# EAGLE design quadcopter (EAGLE 7.5.0)
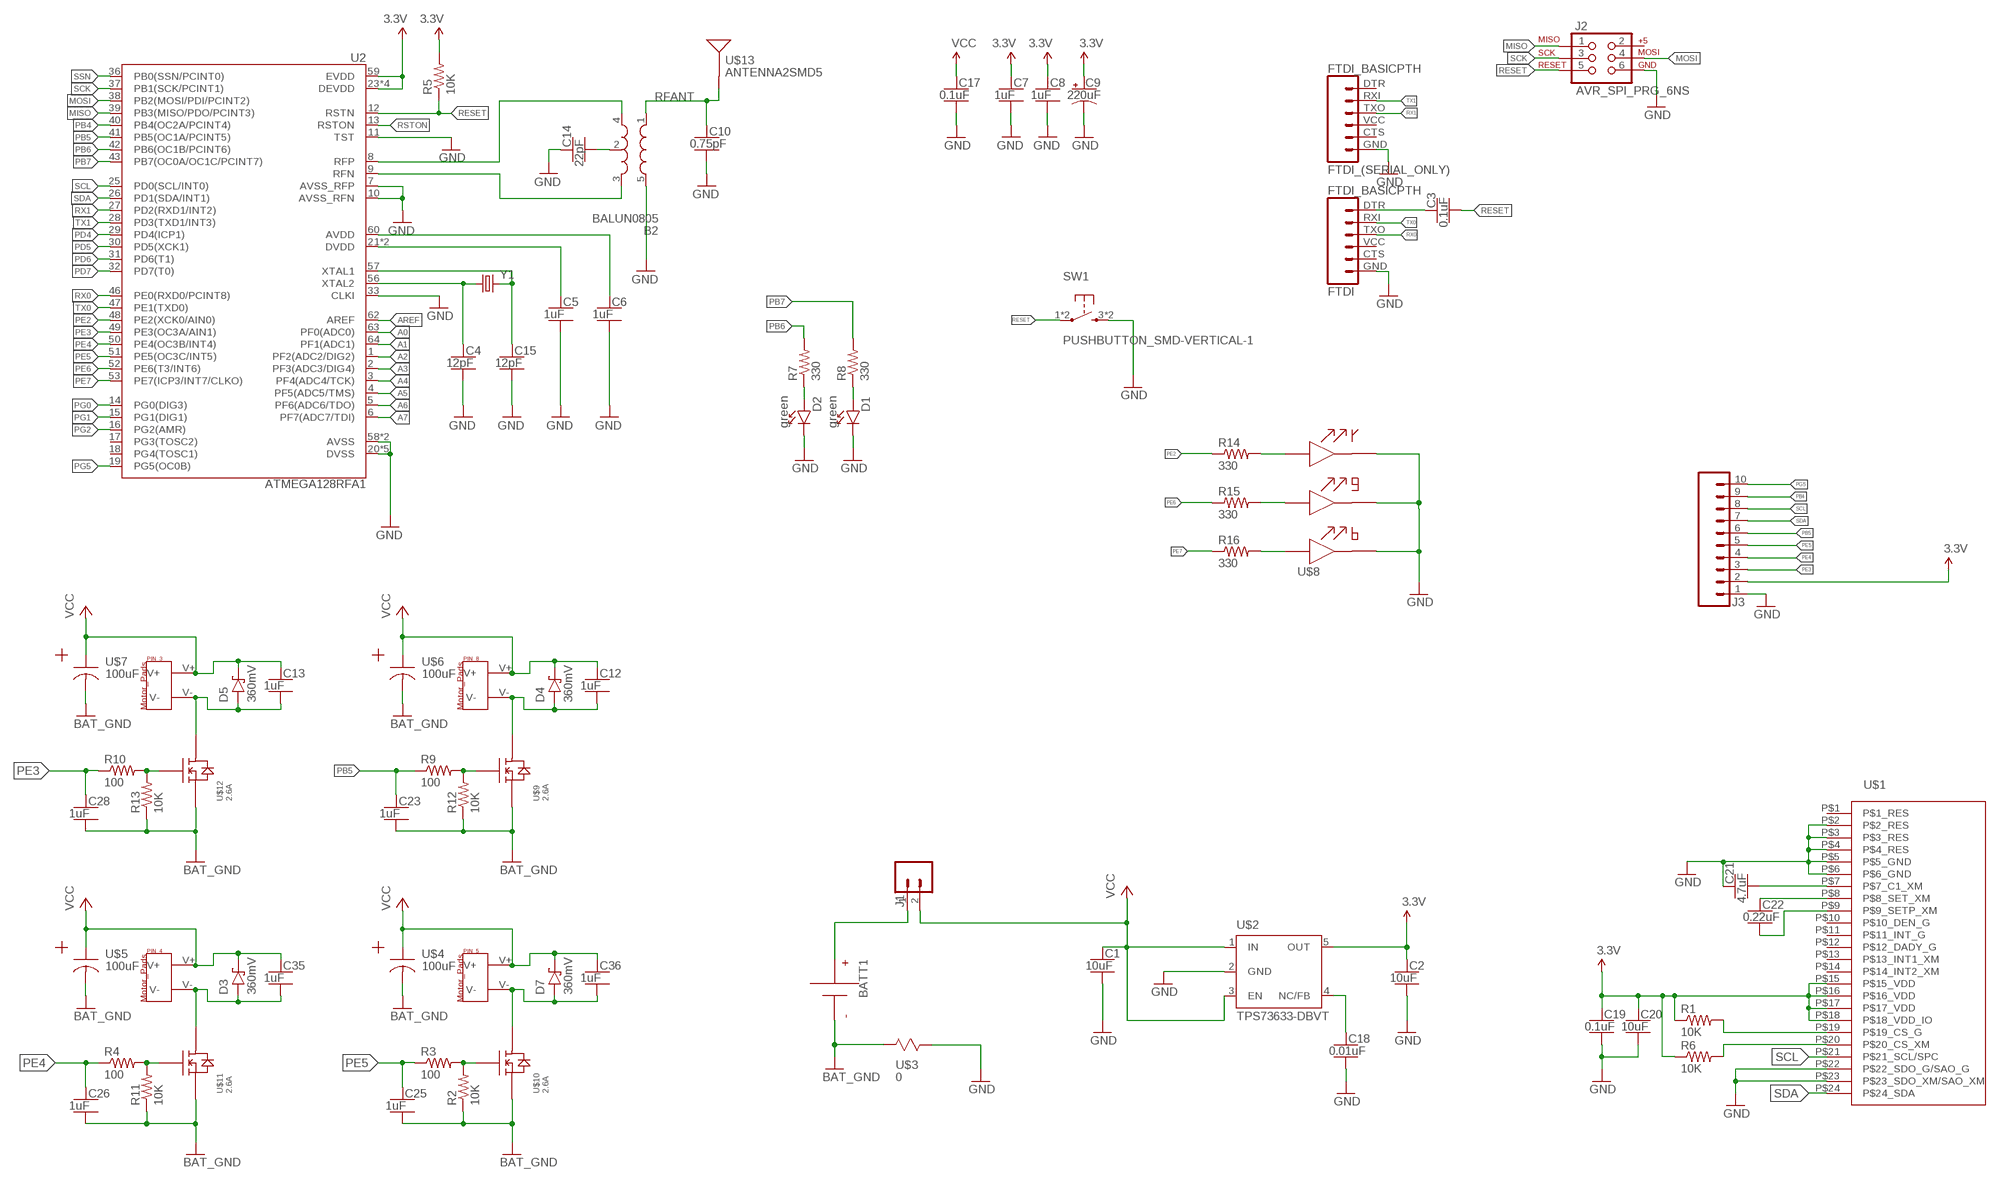
[diagram p0: schematic, sheet 1]

## Parts
B2  BALUN0805  [BALUN]
BATT1  BATTERY-HUBSAN-W/HOLDER  [BATTERY-W/HOLDER-380MAH-HUBSAN]
C1  10uF  CAPACITOR-NP_SMD-2012-0805_CERAMIC-10UF  [CAPC2012X140_HS]
C2  10uF  CAPACITOR-NP_SMD-2012-0805_CERAMIC-10UF  [CAPC2012X140_HS]
C3  0.1uF  CAPACITOR-NP_SMD-2012-0805_CERAMIC-0.1UF  [CAPC2012X140_HS]
C4  12pF  CAPACITOR-NP_SMD-2012-0805_CERAMIC-12PF  [CAPC2012X140_HS]
C5  1uF  CAPACITOR-NP_SMD-2012-0805_CERAMIC-1UF  [CAPC2012X140_HS]
C6  1uF  CAPACITOR-NP_SMD-2012-0805_CERAMIC-1UF  [CAPC2012X140_HS]
C7  1uF  CAPACITOR-NP_SMD-2012-0805_CERAMIC-1UF  [CAPC2012X140_HS]
C8  1uF  CAPACITOR-NP_SMD-2012-0805_CERAMIC-1UF  [CAPC2012X140_HS]
C9  220uF  CAPACITOR-POL_SMD-7043-D_TANTALUM-220UF  [CAPMP7343X310_HS]
C10  0.75pF  CAPACITOR-NP_SMD-2012-0805_CERAMIC-0.75PF  [CAPC2012X140_HS]
C12  1uF  CAPACITOR-NP_SMD-2012-0805_CERAMIC-1UF  [CAPC2012X140_HS]
C13  1uF  CAPACITOR-NP_SMD-2012-0805_CERAMIC-1UF  [CAPC2012X140_HS]
C14  22pF  CAPACITOR-NP_SMD-2012-0805_CERAMIC-22PF  [CAPC2012X140_HS]
C15  12pF  CAPACITOR-NP_SMD-2012-0805_CERAMIC-12PF  [CAPC2012X140_HS]
C17  0.1uF  CAPACITOR-NP_SMD-2012-0805_CERAMIC-0.1UF  [CAPC2012X140_HS]
C18  0.01uF  CAPACITOR-NP_SMD-2012-0805_CERAMIC-0.01UF  [CAPC2012X140_HS]
C19  0.1uF  CAPACITOR-NP_SMD-2012-0805_CERAMIC-0.1UF  [CAPC2012X140_HS]
C20  10uF  CAPACITOR-NP_SMD-2012-0805_CERAMIC-10UF  [CAPC2012X140_HS]
C21  4.7uF  CAPACITOR-NP_SMD-2012-0805_CERAMIC-4.7UF  [CAPC2012X140_HS]
C22  0.22uF  CAPACITOR-NP_SMD-2012-0805_CERAMIC-0.22UF  [CAPC2012X140_HS]
C23  1uF  CAPACITOR-NP_SMD-2012-0805_CERAMIC-1UF  [CAPC2012X140_HS]
C25  1uF  CAPACITOR-NP_SMD-2012-0805_CERAMIC-1UF  [CAPC2012X140_HS]
C26  1uF  CAPACITOR-NP_SMD-2012-0805_CERAMIC-1UF  [CAPC2012X140_HS]
C28  1uF  CAPACITOR-NP_SMD-2012-0805_CERAMIC-1UF  [CAPC2012X140_HS]
C35  1uF  CAPACITOR-NP_SMD-2012-0805_CERAMIC-1UF  [CAPC2012X140_HS]
C36  1uF  CAPACITOR-NP_SMD-2012-0805_CERAMIC-1UF  [CAPC2012X140_HS]
D1  green  DIODE-LED_SMD-2012-0805-GREEN  [LEDSC125X200X120-2_HS]
D2  green  DIODE-LED_SMD-2012-0805-GREEN  [LEDSC125X200X120-2_HS]
D3  360mV  DIODE-SCHOTTKY_SMD-SOD123-360MV  [SOD3716X135_HS]
D4  360mV  DIODE-SCHOTTKY_SMD-SOD123-360MV  [SOD3716X135_HS]
D5  360mV  DIODE-SCHOTTKY_SMD-SOD123-360MV  [SOD3716X135_HS]
D7  360mV  DIODE-SCHOTTKY_SMD-SOD123-360MV  [SOD3716X135_HS]
FTDI  FTDI_BASICPTH  [FTDI_BASIC]
FTDI_(SERIAL_ONLY)  FTDI_BASICPTH  [FTDI_BASIC]
J1  MALE_HEADER_2POS-2X1-0.1IN  [MALE_HEADER_2X1_0.1IN]
J2  AVR_SPI_PRG_6NS  [2X3-NS]
J3  SIP-10_TH-254X10-1  [HDRV10W63P254_10X1_2540X254H838_HS]
PIN_3  MOTOR_PADS  [MOTOR_PADS]
PIN_4  MOTOR_PADS  [MOTOR_PADS]
PIN_5  MOTOR_PADS  [MOTOR_PADS]
PIN_8  MOTOR_PADS  [MOTOR_PADS]
R1  10K  RESISTOR_SMD-2012-0805-10K  [RESC2012X60_HS]
R2  10K  RESISTOR_SMD-2012-0805-10K  [RESC2012X60_HS]
R3  100  RESISTOR_SMD-2012-0805-100  [RESC2012X60_HS]
R4  100  RESISTOR_SMD-2012-0805-100  [RESC2012X60_HS]
R5  10K  RESISTOR_SMD-2012-0805-10K  [RESC2012X60_HS]
R6  10K  RESISTOR_SMD-2012-0805-10K  [RESC2012X60_HS]
R7  330  RESISTOR_SMD-2012-0805-330  [RESC2012X60_HS]
R8  330  RESISTOR_SMD-2012-0805-330  [RESC2012X60_HS]
R9  100  RESISTOR_SMD-2012-0805-100  [RESC2012X60_HS]
R10  100  RESISTOR_SMD-2012-0805-100  [RESC2012X60_HS]
R11  10K  RESISTOR_SMD-2012-0805-10K  [RESC2012X60_HS]
R12  10K  RESISTOR_SMD-2012-0805-10K  [RESC2012X60_HS]
R13  10K  RESISTOR_SMD-2012-0805-10K  [RESC2012X60_HS]
R14  330  RESISTOR_SMD-2012-0805-330  [RESC2012X60_HS]
R15  330  RESISTOR_SMD-2012-0805-330  [RESC2012X60_HS]
R16  330  RESISTOR_SMD-2012-0805-330  [RESC2012X60_HS]
SW1  PUSHBUTTON_SMD-VERTICAL-1  [TE_FSM8JSMA_HS]
U2  ATMEGA128RFA1  [QFN-64]
U$1  IMU  [LGA-24_4X4MM]
U$2  TPS73633-DBVT  [SOT23-DBV]
U$3  0  RESISTOR  [SMD_RESISTOR]
U$4  100uF  POLAR_CAP  [TAJB_SMB_POLAR_CAP]
U$5  100uF  POLAR_CAP  [TAJB_SMB_POLAR_CAP]
U$6  100uF  POLAR_CAP  [TAJB_SMB_POLAR_CAP]
U$7  100uF  POLAR_CAP  [TAJB_SMB_POLAR_CAP]
U$8  QBLP679E-RGB  [QBLP679E-RGB]
U$9  2.6A  N-CHANNEL_MOSFETW/_HEAT_SINK  [LITTLE_FOOT_MOSFET_W/_HEAT_SPREADER]
U$10  2.6A  N-CHANNEL_MOSFETW/_HEAT_SINK  [LITTLE_FOOT_MOSFET_W/_HEAT_SPREADER]
U$11  2.6A  N-CHANNEL_MOSFETW/_HEAT_SINK  [LITTLE_FOOT_MOSFET_W/_HEAT_SPREADER]
U$12  2.6A  N-CHANNEL_MOSFETW/_HEAT_SINK  [LITTLE_FOOT_MOSFET_W/_HEAT_SPREADER]
U$13  ANTENNA2SMD5  [ANTENNA-CHIP5]
Y1  CRYSTAL5X3  [CRYSTAL-SMD-5X3]

## Nets
3.3V: C2.1 C7.1 C8.1 C9.1(+) C19.1 C20.1 J3.2 R1.1 R5.2 R6.1 U2.23(DEVDD) U2.34(DEVDD) U2.44(DEVDD) U2.54(DEVDD) U2.59(EVDD) U$1.P$15(P$15_VDD) U$1.P$16(P$16_VDD) U$1.P$17(P$17_VDD) U$1.P$18(P$18_VDD_IO) U$2.5(OUT)
A0: U2.63(PF0(ADC0))
A1: U2.64(PF1(ADC1))
A2: U2.1(PF2(ADC2/DIG2))
A3: U2.2(PF3(ADC3/DIG4))
A4: U2.3(PF4(ADC4/TCK))
A5: U2.4(PF5(ADC5/TMS))
A6: U2.5(PF6(ADC6/TDO))
A7: U2.6(PF7(ADC7/TDI))
AREF: U2.62(AREF)
AVDD: C6.1 U2.60(AVDD)
BAT_GND: BATT1.-(N) C23.2 C25.2 C26.2 C28.2 R2.1 R11.1 R12.1 R13.1 U$3.P$1 U$4.P$2 U$5.P$2 U$6.P$2 U$7.P$2 U$9.P$2(P$2_S) U$10.P$2(P$2_S) U$11.P$2(P$2_S) U$12.P$2(P$2_S)
DTR: C3.1 FTDI.DTR
DVDD: C5.1 U2.21(DVDD) U2.22(DVDD)
GND: B2.5(GND) C1.2 C2.2 C4.2 C5.2 C6.2 C7.2 C8.2 C9.2(-) C10.2 C14.1 C15.2 C17.2 C18.2 C19.2 C20.2 C21.1 D1.C D2.C FTDI.GND FTDI_(SERIAL_ONLY).GND J2.6 J3.1 SW1.3 SW1.4 U2.7(AVSS_RFP) U2.10(AVSS_RFN) U2.11(TST) U2.20(DVSS) U2.24(DVSS) U2.33(CLKI) U2.35(DVSS) U2.45(DVSS) U2.55(DVSS) U2.58(AVSS) U2.61(AVSS) U$1.P$2(P$2_RES) U$1.P$3(P$3_RES) U$1.P$4(P$4_RES) U$1.P$5(P$5_GND) U$1.P$6(P$6_GND) U$1.P$22(P$22_SDO_G/SAO_G) U$1.P$23(P$23_SDO_XM/SAO_XM) U$2.2(GND) U$3.P$2 U$8.P$1 U$8.P$2 U$8.P$3
MISO: J2.1 U2.39(PB3(MISO/PDO/PCINT3))
MOSI: J2.4 U2.38(PB2(MOSI/PDI/PCINT2))
N$1: R14.2 U$8.P$4
N$2: R15.2 U$8.P$5
N$3: C15.1 U2.57(XTAL1) Y1.3
N$4: C4.1 U2.56(XTAL2) Y1.1
N$5: C18.1 U$2.4(NC/FB)
N$6: C21.2 U$1.P$7(P$7_C1_XM)
N$7: B2.2(GND) C14.2
N$8: D2.A R7.1
N$9: R16.2 U$8.P$6
N$12: C22.1 U$1.P$8(P$8_SET_XM)
N$13: D1.A R8.1
N$14: C22.2 U$1.P$9(P$9_SETP_XM)
N$15: R1.2 U$1.P$19(P$19_CS_G)
N$16: R6.2 U$1.P$20(P$20_CS_XM)
N$17: BATT1.+(P) J1.1
N$18: R9.2 R12.2 U$9.P$1(P$1_G)
N$19 [HighAmps]: C12.2 D4.A PIN_8.V- U$9.P$3(P$3_D)
N$21: R2.2 R3.2 U$10.P$1(P$1_G)
N$22 [HighAmps]: C36.2 D7.A PIN_5.V- U$10.P$3(P$3_D)
N$24: R10.2 R13.2 U$12.P$1(P$1_G)
N$25 [HighAmps]: C13.2 D5.A PIN_3.V- U$12.P$3(P$3_D)
N$27: R4.2 R11.2 U$11.P$1(P$1_G)
N$28 [HighAmps]: C35.2 D3.A PIN_4.V- U$11.P$3(P$3_D)
PB4: J3.9 U2.40(PB4(OC2A/PCINT4))
PB5: C23.1 J3.6 R9.1 U2.41(PB5(OC1A/PCINT5))
PB6: R7.2 U2.42(PB6(OC1B/PCINT6))
PB7: R8.2 U2.43(PB7(OC0A/OC1C/PCINT7))
PD4: U2.29(PD4(ICP1))
PD5: U2.30(PD5(XCK1))
PD6: U2.31(PD6(T1))
PD7: U2.32(PD7(T0))
PE2: R14.1 U2.48(PE2(XCK0/AIN0))
PE3: C28.1 J3.3 R10.1 U2.49(PE3(OC3A/AIN1))
PE4: C26.1 J3.4 R4.1 U2.50(PE4(OC3B/INT4))
PE5: C25.1 J3.5 R3.1 U2.51(PE5(OC3C/INT5))
PE6: R15.1 U2.52(PE6(T3/INT6))
PE7: R16.1 U2.53(PE7(ICP3/INT7/CLKO))
PG0: U2.14(PG0(DIG3))
PG1: U2.15(PG1(DIG1))
PG2: U2.16(PG2(AMR))
PG5: J3.10 U2.19(PG5(OC0B))
RESET: C3.2 J2.5 R5.1 SW1.1 SW1.2 U2.12(RSTN)
RFANT: B2.1(IN) C10.1 U$13.FEED(SIGNAL)
RFN: B2.3(OUT2) U2.9(RFN)
RFP: B2.4(OUT1) U2.8(RFP)
RSTON: U2.13(RSTON)
RX0: FTDI.TXO U2.46(PE0(RXD0/PCINT8))
RX1: FTDI_(SERIAL_ONLY).TXO U2.27(PD2(RXD1/INT2))
SCK: J2.3 U2.37(PB1(SCK/PCINT1))
SCL: J3.8 U2.25(PD0(SCL/INT0)) U$1.P$21(P$21_SCL/SPC)
SDA: J3.7 U2.26(PD1(SDA/INT1)) U$1.P$24(P$24_SDA)
SSN: U2.36(PB0(SSN/PCINT0))
TX0: FTDI.RXI U2.47(PE1(TXD0))
TX1: FTDI_(SERIAL_ONLY).RXI U2.28(PD3(TXD1/INT3))
VCC: C1.1 C12.1 C13.1 C17.1 C35.1 C36.1 D3.C D4.C D5.C D7.C J1.2 PIN_3.V+ PIN_4.V+ PIN_5.V+ PIN_8.V+ U$2.1(IN) U$2.3(EN) U$4.P$1 U$5.P$1 U$6.P$1 U$7.P$1
Unconnected: FTDI.CTS FTDI.VCC FTDI_(SERIAL_ONLY).CTS FTDI_(SERIAL_ONLY).DTR FTDI_(SERIAL_ONLY).VCC J2.2 U2.17(PG3(TOSC2)) U2.18(PG4(TOSC1)) U$1.P$1(P$1_RES) U$1.P$10(P$10_DEN_G) U$1.P$11(P$11_INT_G) U$1.P$12(P$12_DADY_G) U$1.P$13(P$13_INT1_XM) U$1.P$14(P$14_INT2_XM)

## Library data of the parts
B2 = quadparts_prebuilt:BALUN: 0805 footprint balun- Ember 351/357; DATASHEET: http://katalog.we-online.de/pbs/datasheet/748421245.pdf; DIST: Digikey; DISTPN: 732-2230-6-ND; MFR: Wurth Electronics Inc; MPN: 748421245; PRICE: 2.63
BATT1 = quadparts_prebuilt:BATTERY; CREATOR: Swanson; DIST: AMAZON; DISTPN: http://www.amazon.com/dp/B00RROB6Q4?smid=AMNTPWSAB5H0S; MFR: HUBSAN; MPN: X4-H107C-8-in-1
C1 C2 C20 = quadparts_prebuilt:CAPACITOR-NP_: Nonpolarized capacitor; DIST: Digikey; DISTPN: 490-5523-1-ND; MFR: Murata Electronics North America; MPN: GRM21BR61E106KA73L
C3 C17 C19 = quadparts_prebuilt:CAPACITOR-NP_: Nonpolarized capacitor; DIST: Digikey; DISTPN: 490-1666-1-ND; MFR: Murata Electronics North America; MPN: GRM21BR71H104KA01L
C4 C15 = quadparts_prebuilt:CAPACITOR-NP_: Nonpolarized capacitor; DIST: Digikey; DISTPN: 490-5531-1-ND; MFR: Murata Electronics North America; MPN: GRM21A5C2E120JW01D
C5-C8 C12 C13 C23 C25 C26 C28 C35 C36 = quadparts_prebuilt:CAPACITOR-NP_: Nonpolarized capacitor; DIST: Digikey; DISTPN: 490-4736-1-ND; MFR: Murata Electronics North America; MPN: GRM21BR71H105KA12L
C9 = quadparts_prebuilt:CAPACITOR-POL_: Polarized capacitor; DIST: Digikey; DISTPN: 478-8912-1-ND; MFR: AVX Corporation; MPN: TAJD227K006RNJ
C10 = quadparts_prebuilt:CAPACITOR-NP_: Nonpolarized capacitor; DIST: Digikey; DISTPN: 490-3585-1-ND; MFR: Murata Electronics North America; MPN: GQM2195C2AR75CB01D
C14 = quadparts_prebuilt:CAPACITOR-NP_: Nonpolarized capacitor; DIST: Digikey; DISTPN: 490-5534-1-ND; MFR: Murata Electronics North America; MPN: GRM21A5C2E220JW01D
C18 = quadparts_prebuilt:CAPACITOR-NP_: Nonpolarized capacitor; DIST: Digikey; DISTPN: 490-8295-1-ND; MFR: Murata Electronics North America; MPN: GRM2195C1H103FA01D
C21 = quadparts_prebuilt:CAPACITOR-NP_: Nonpolarized capacitor; DIST: Digikey; DISTPN: 490-3335-1-ND; MFR: Murata Electronics North America; MPN: GRM21BR61E475KA12L
C22 = quadparts_prebuilt:CAPACITOR-NP_: Nonpolarized capacitor; DIST: Digikey; DISTPN: 490-1670-1-ND; MFR: Murata Electronics North America; MPN: GRM21BR71H224KA01L
D1 D2 = quadparts_prebuilt:DIODE-LED_: Light emitting diode; DIST: Digikey; DISTPN: 160-1179-1-ND; MFR: Lite-On Inc; MPN: LTST-C170GKT
D3-D5 D7 = quadparts_prebuilt:DIODE-SCHOTTKY_: Schottky diode; DIST: Digikey; DISTPN: CRS08QMCT-ND; MFR: Toshiba Semiconductor and Storage; MPN: CRS08(TE85L,Q,M)
FTDI FTDI_(SERIAL_ONLY) = quadparts_prebuilt:FTDI_BASIC: FTDI Basic header with labels; DATASHEET: http://portal.fciconnect.com/Comergent//fci/drawing/68015.pdf; DIST: Digikey; DISTPN: 609-3327-ND; MFR: Amphenol FCI; MPN: 68016-406HLF; PRICE: 0.33
J1 = quadparts-rev2:MALE_HEADER_2POS: 2 pin single inline pin header, socket, or connector; CREATOR: SWANSON; DIST: Digikey; DISTPN: 3M9447-ND; MFR: 3M; MPN: 961102-6404-AR
J2 = quadparts_prebuilt:AVR_SPI_PRG_6: AVR ISP 6 Pin This is the reduced ISP connector for AVR programming. Common on Arduino. This footprint will take up less PCB space and can be used with a 10-pin to 6-pin adapter such as SKU: BOB-08508; DATASHEET: http://portal.fciconnect.com/Comergent//fci/drawing/67996.pdf; DIST: Digikey; DISTPN: 609-3234-ND; MFR: Amphenol FCI; MPN: 67997-206HLF; PRICE: 0.31
J3 = quadparts_prebuilt:SIP-10_: 10 pin single inline pin header, socket, or connector; DIST: Digikey; DISTPN: 609-3250-ND; MFR: Amphenol FCI; MPN: 68000-110HLF
PIN_3-PIN_5 PIN_8 = quadparts_prebuilt:MOTOR_PADS; DIST: NA; DISTPN: NA; MFR: NA; MPN: NA
R1 R2 R5 R6 R11-R13 = quadparts_prebuilt:RESISTOR_: Resistor; DIST: Digikey; DISTPN: 311-10KARCT-ND; MFR: Yageo; MPN: RC0805JR-0710KL
R3 R4 R9 R10 = quadparts_prebuilt:RESISTOR_: Resistor; DIST: Digikey; DISTPN: 311-100ARCT-ND; MFR: Yageo; MPN: RC0805JR-07100RL
R7 R8 R14-R16 = quadparts_prebuilt:RESISTOR_: Resistor; DIST: Digikey; DISTPN: 311-330ARCT-ND; MFR: Yageo; MPN: RC0805JR-07330RL
SW1 = quadparts_prebuilt:PUSHBUTTON_: Pushbutton with 2 pins shorting 1 to 2 and two extra mounting pins 3 & 4; DIST: Digikey; DISTPN: 450-1129-ND; MFR: TE Connectivity Alcoswitch Switches; MPN: FSM4JSMA
U2 = quadparts_prebuilt:ATMEGA128RFA1: ATmega128RFA1 8-bit AVR Microcontroller with Low Power 2.4GHz Transceiver for ZigBee and IEEE 802.15.4; DATASHEET: http://www.atmel.com/Images/Atmel-8266-MCU_Wireless-ATmega128RFA1_Datasheet.pdf; DIST: Digikey; DISTPN: ATMEGA128RFA1-ZUR00DKR-ND; MFR: Atmel; MPN: ATMEGA128RFA1-ZUR00; PRICE: 10.21
U$1 = quadparts:IMU; CREATOR: Xuefei; DIST: DIGIKEY; DISTPN: 497-13902-1-ND; MFR: STMicroelectronics; MPN: LSM9DS0TR
U$2 = quadparts_prebuilt:TPS73633-DBVT; DATASHEET: http://www.ti.com/lit/ds/symlink/lp3985.pdf; DIST: Digikey; DISTPN: LP3985IM5X-3.0/NOPBCT-ND; MFR: Texas Instruments; MPN: LP3985IM5X-3.0/NOPB; PRICE: 0.59
U$3 = quadparts:RESISTOR; CREATOR: Xuefei; DIST: DIGIKEY; DISTPN: 311-0.0ARCT-ND; MFR: Yageo; MPN: RC0805JR-070RL
U$4-U$7 = quadparts:POLAR_CAP; CREATOR: Xuefei; DIST: DIGIKEY; DISTPN: 478-1677-1-ND; MFR: AVX Corporation; MPN: TAJB107K006RNJ
U$8 = quadparts:QBLP679E-RGB; CREATOR: Xuefei; DIST: DIGIKEY; DISTPN: 1516-1131-1-ND; MFR: QT Brightek (QTB); MPN: QBLP679E-RGB
U$9-U$12 = quadparts:N-CHANNEL_MOSFET; CREATOR: Xuefei; DIST: DIGIKEY; DISTPN: SI2302CDS-T1-E3CT-ND; MFR: Vishay Siliconix; MPN: SI2302CDS-T1-E3
U$13 = quadparts_prebuilt:ANTENNA2: Chip antenna Single endded antenna. Common with smaller chip antennas. CHIP4 package is the GPS Chip Antenna SKU: GPS-08418. CHIP5 package is 2.4GHz chip antenna SKU: WRL-00144.; DATASHEET: http://www.linxtechnologies.com/resources/data-guides/ant-xxx-chp-x.pdf; DIST: Digikey; DISTPN: ANT-2.45-CHPCT-ND; MFR: Linx Technologies Inc.; MPN: ANT-2.45-CHP-T; PRICE: 3.16
Y1 = quadparts_prebuilt:CRYSTAL: Various standard crystals. Proven footprints.; DATASHEET: http://www.abracon.com/Resonators/abm3b.pdf; DIST: Digikey; DISTPN: 535-9122-1-ND; MFR: Abracon LLC; MPN: ABM3B-16.000MHZ-B2-T; PRICE: 0.68; PROD_ID: XTAL-08218

## Net classes
1 HighAmps: width 0.762 mm

## Board
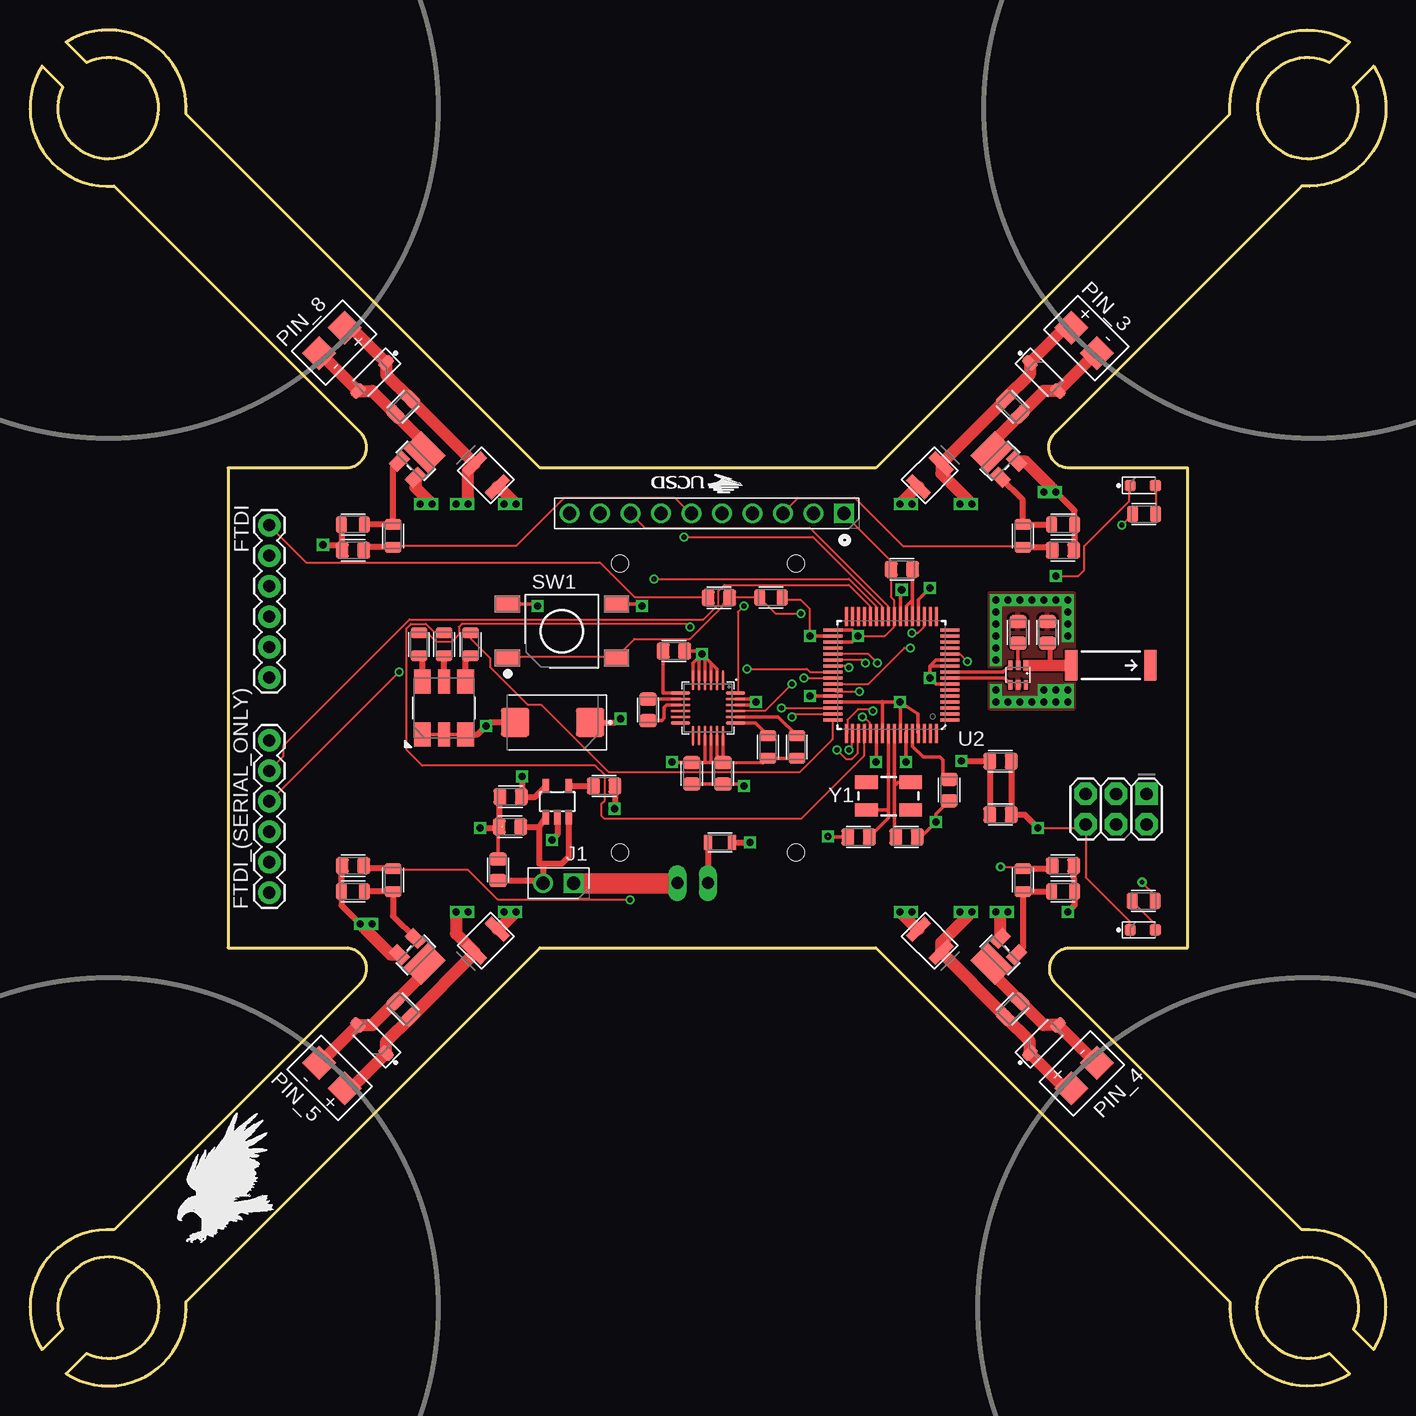
[diagram p1: board, top side]
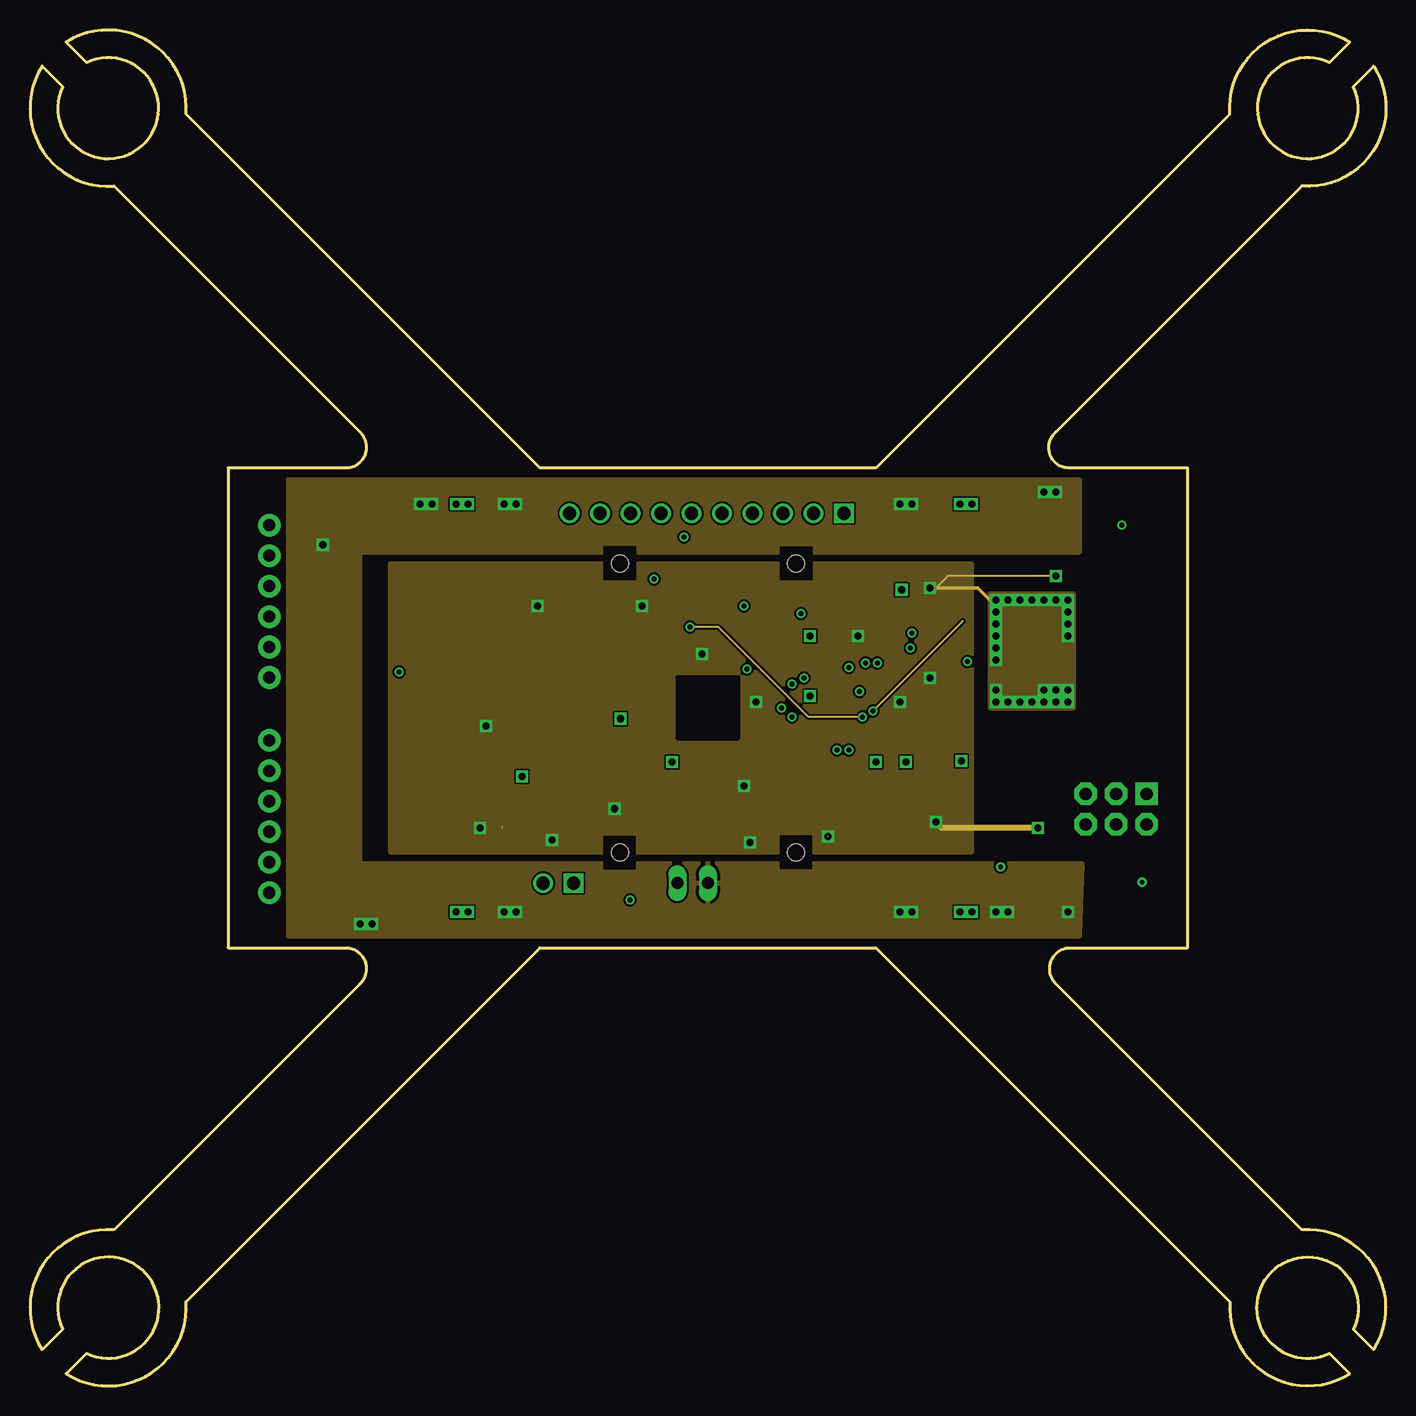
[diagram p2: board, inner layer Route2]
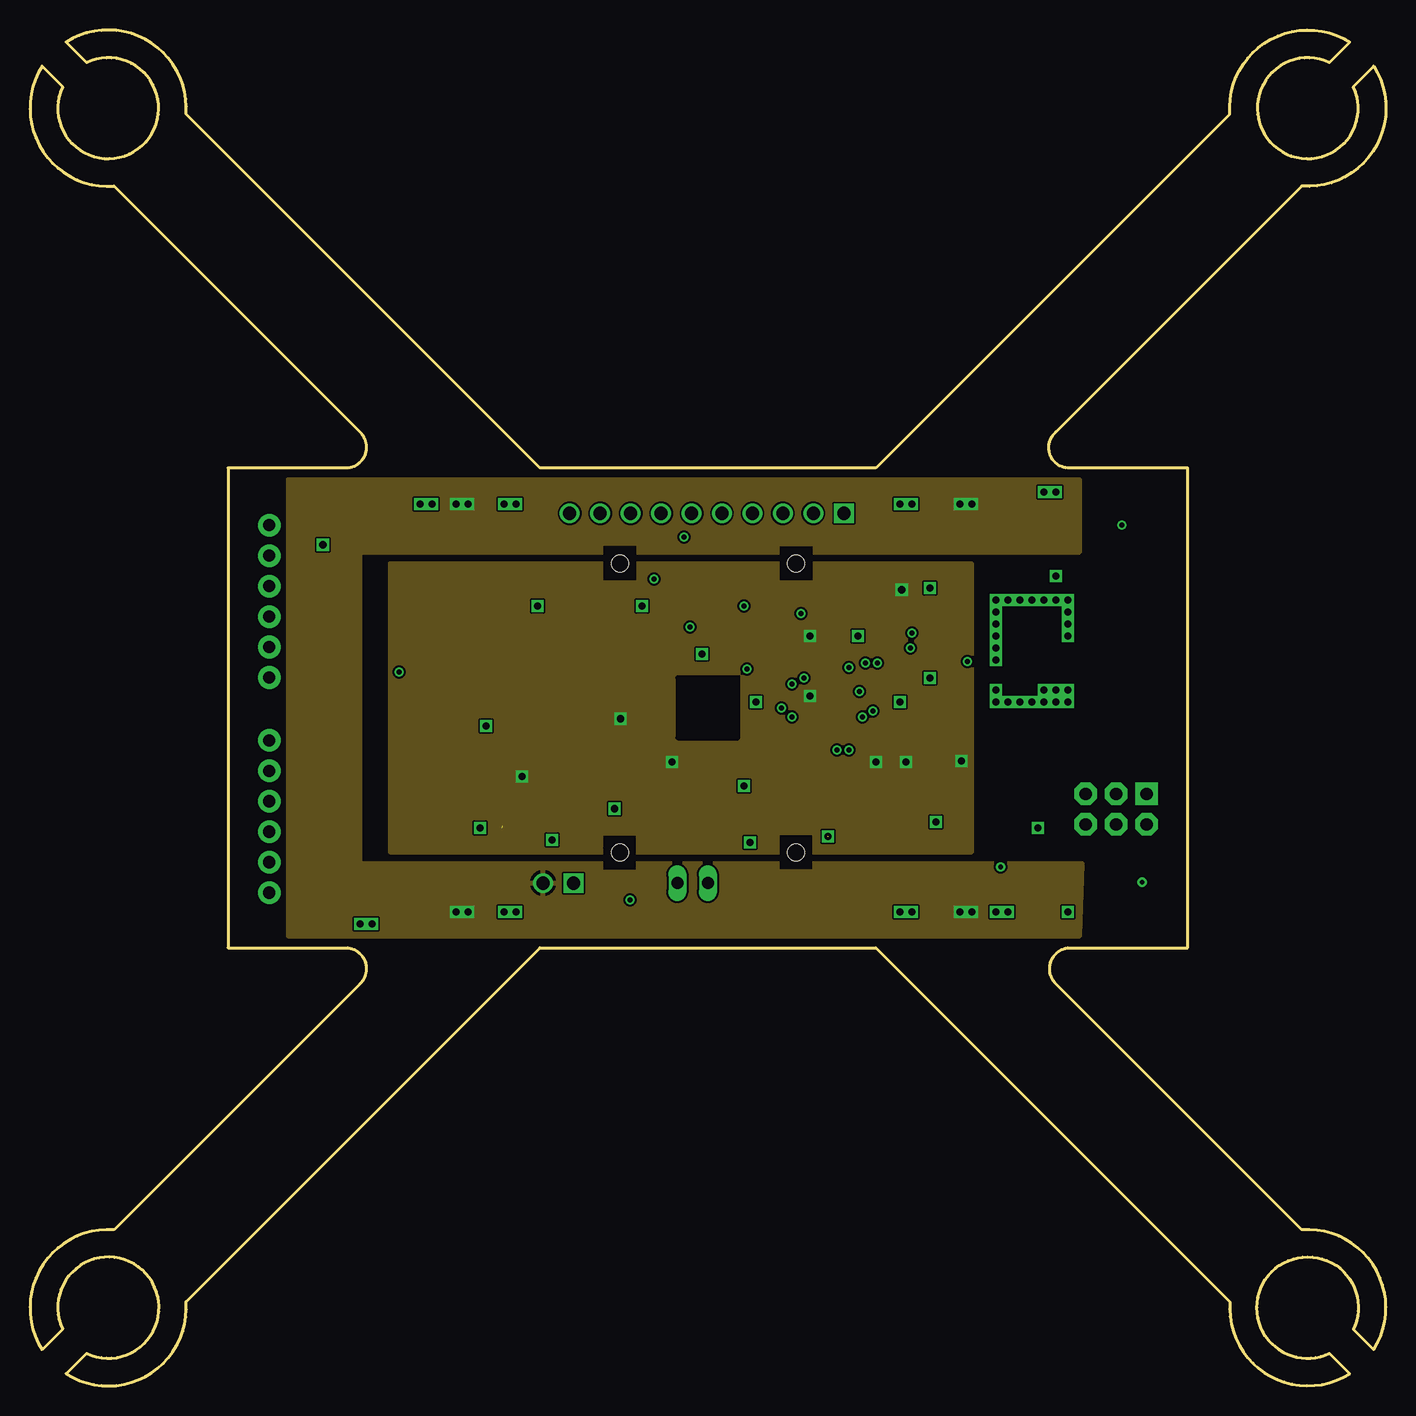
[diagram p3: board, inner layer Route15]
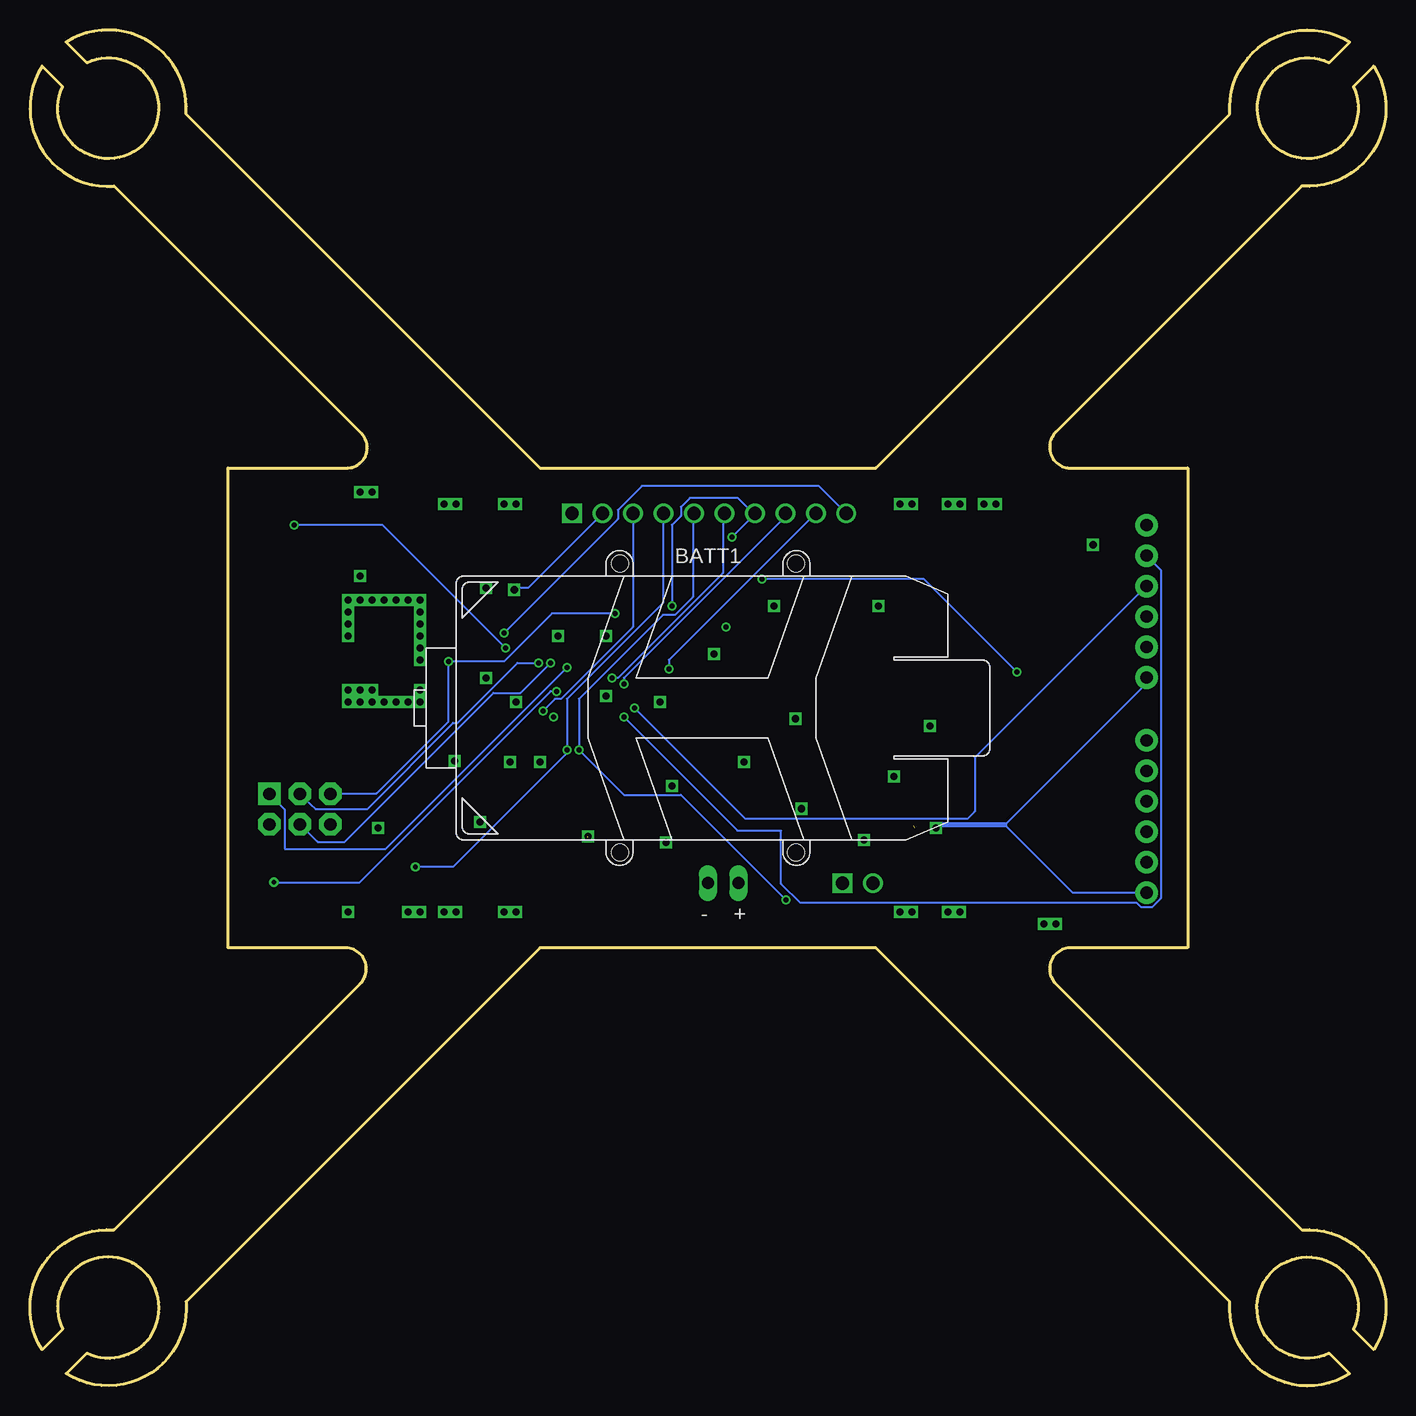
[diagram p4: board, bottom side, seen from below]

Size 113.04 x 113.04 mm. Coordinates in mm from the lower left corner, seen from the top.
Outline: 86.52,76.52 96.52,76.52 96.52,36.52 86.52,36.52 arc127 85.52,33.52 106.02,13.02 arc-127 112.02,3.02 110.32,4.72 arc70 109.52,9.52 arc180 103.52,3.52 arc70 108.32,2.72 110.02,1.02 arc-126 100.02,7.02 70.52,36.52 42.52,36.52 13.02,7.02 arc-127 3.02,1.02 4.72,2.72 arc321 2.72,4.72 1.02,3.02 arc-127 7.02,13.02 27.52,33.52 arc127 26.52,36.52 16.52,36.52 16.52,76.52 26.52,76.52 arc127 27.52,79.52 7.02,100.02 arc-127 1.02,110.02 2.72,108.32 arc321 4.72,110.32 3.02,112.02 arc-127 13.02,106.02 42.52,76.52 70.52,76.52 100.02,106.02 arc-127 110.02,112.02 108.32,110.32 arc321 110.32,108.32 112.02,110.02 arc-127 106.02,100.02 85.52,79.52
Outline: 86.52,76.52 arc-135 85.52,79.52
Outline: 86.52,76.52 arc-135 85.52,79.52
Copper layers (1*2*15*16): Top 0.035559375mm / dielectric 1.501140625mm / Route2 0.035559375mm / dielectric 0.149859375mm / Route15 0.035559375mm / dielectric 0.200659375mm / Bottom 0.035559375mm
Design rules "4pcb-33board *": minimum track width 6mil, minimum drill 15mil, track to track 6mil, track to pad 6mil, pad to pad 6mil, via to via 6mil, smd to smd 6mil, copper to edge 10mil, drill to drill 10mil, minimum pad ring 10mil, minimum via ring 8mil, stop-mask expansion 4mil, vias tented up to drill 0mil, thermal gap 10mil
bKeepout: area 54,54 to 59,59
tRestrict: area 87.5,54.5 to 92.2,66.5; area 92.6,54.5 to 96,66.5
bRestrict: area 87.5,54.5 to 96,66.5; area 54,54 to 59,59; area 79.8,57.9 to 87.1,64.6

### Footprints (pad centres in the part's own frame; a part is rotated, then mirrored left to right if it is on the bottom)
BALUN = smd 0.35 x 0.8: 1 -0.65,-0.8; 2 0,-0.8; 3 0.65,-0.8; 4 0.65,0.8; 5 0,0.8; 6 -0.65,0.8
BATTERY-W/HOLDER-380MAH-HUBSAN = drill 1 long: + -2.54,14.605; - 0,14.605 | hole 1.4: -7.35,-12.05; -7.35,12.05; 7.35,-12.05; 7.35,12.05
CAPC2012X140_HS = smd 1.08 x 1.42: 1 -0.895,0; 2 0.895,0
CAPMP7343X310_HS = smd 2.37 x 2.43: 1 -3.12,0; 2 3.12,0
LEDSC125X200X120-2_HS = smd 0.94 x 0.99: A 1.045,0; C -1.045,0
SOD3716X135_HS = smd 1.25 x 0.8: A 1.665,0; C -1.665,0
FTDI_BASIC = drill 1.016 pad 1.88: CTS 10.16,0; DTR 0,0; GND 12.7,0; RXI 2.54,0; TXO 5.08,0; VCC 7.62,0
MALE_HEADER_2X1_0.1IN = drill 1.1 pad 1.65 square: 1 0,0 | drill 1.1 pad 1.65: 2 2.54,0
2X3-NS = drill 1.016 pad 1.88 square: 1 -2.54,-1.27 | drill 1.016 pad 1.88 octagon: 2 -2.54,1.27; 3 0,-1.27; 4 0,1.27; 5 2.54,-1.27; 6 2.54,1.27
HDRV10W63P254_10X1_2540X254H838_HS = drill 1.1 pad 1.65 square: 1 0,0 | drill 1.1 pad 1.65: 2 2.54,0; 3 5.08,0; 4 7.62,0; 5 10.16,0; 6 12.7,0; 7 15.24,0; 8 17.78,0; 9 20.32,0; 10 22.86,0
MOTOR_PADS = smd 2 x 2: V+ -1,0; V- 2,0
RESC2012X60_HS = smd 0.92 x 1.38: 1 -0.955,0; 2 0.955,0
TE_FSM8JSMA_HS = smd 1.4 x 2.1: 1 -2.25,4.55; 2 -2.25,-4.55; 3 2.25,4.55; 4 2.25,-4.55
QFN-64 = smd 1.562 x 0.28: 1 -4.881,3.75; 2 -4.881,3.25; 3 -4.881,2.75; 4 -4.881,2.25; 5 -4.881,1.75; 6 -4.881,1.25; 7 -4.881,0.75; 8 -4.881,0.25; 9 -4.881,-0.25; 10 -4.881,-0.75; 11 -4.881,-1.25; 12 -4.881,-1.75; 13 -4.881,-2.25; 14 -4.881,-2.75; 15 -4.881,-3.25; 16 -4.881,-3.75; 33 4.881,-3.75; 34 4.881,-3.25; 35 4.881,-2.75; 36 4.881,-2.25; 37 4.881,-1.75; 38 4.881,-1.25; 39 4.881,-0.75; 40 4.881,-0.25; 41 4.881,0.25; 42 4.881,0.75; 43 4.881,1.25; 44 4.881,1.75; 45 4.881,2.25; 46 4.881,2.75; 47 4.881,3.25; 48 4.881,3.75 | smd 0.28 x 1.562: 17 -3.75,-4.881; 18 -3.25,-4.881; 19 -2.75,-4.881; 20 -2.25,-4.881; 21 -1.75,-4.881; 22 -1.25,-4.881; 23 -0.75,-4.881; 24 -0.25,-4.881; 25 0.25,-4.881; 26 0.75,-4.881; 27 1.25,-4.881; 28 1.75,-4.881; 29 2.25,-4.881; 30 2.75,-4.881; 31 3.25,-4.881; 32 3.75,-4.881; 49 3.75,4.881; 50 3.25,4.881; 51 2.75,4.881; 52 2.25,4.881; 53 1.75,4.881; 54 1.25,4.881; 55 0.75,4.881; 56 0.25,4.881; 57 -0.25,4.881; 58 -0.75,4.881; 59 -1.25,4.881; 60 -1.75,4.881; 61 -2.25,4.881; 62 -2.75,4.881; 63 -3.25,4.881; 64 -3.75,4.881
LGA-24_4X4MM = smd 0.2 x 1.6: P$1 1.25,2.3; P$2 0.75,2.3; P$3 0.25,2.3; P$4 -0.25,2.3; P$5 -0.75,2.3; P$6 -1.25,2.3; P$13 -1.25,-2.3; P$14 -0.75,-2.3; P$15 -0.25,-2.3; P$16 0.25,-2.3; P$17 0.75,-2.3; P$18 1.25,-2.3 | smd 1.6 x 0.2: P$7 -2.3,1.25; P$8 -2.3,0.75; P$9 -2.3,0.25; P$10 -2.3,-0.25; P$11 -2.3,-0.75; P$12 -2.3,-1.25; P$19 2.3,-1.25; P$20 2.3,-0.75; P$21 2.3,-0.25; P$22 2.3,0.25; P$23 2.3,0.75; P$24 2.3,1.25
SOT23-DBV = smd 0.55 x 1.2: 1 -0.95,-1.3; 2 0,-1.3; 3 0.95,-1.3; 4 0.95,1.3; 5 -0.95,1.3
SMD_RESISTOR = smd 0.7 x 1.25: P$1 -1,0; P$2 1,0
TAJB_SMB_POLAR_CAP = smd 0.8 x 2.2: P$1 -1.35,0; P$2 1.35,0
QBLP679E-RGB = smd 2 x 1.4: P$1 2.2,-1.8; P$3 2.2,1.8; P$4 -2.2,1.8; P$6 -2.2,-1.8 | smd 2 x 1: P$2 2.2,0; P$5 -2.2,0
LITTLE_FOOT_MOSFET_W/_HEAT_SPREADER = smd 1 x 1.5: P$1 -0.95,-1; P$2 0.95,-1 | smd 2.9 x 2.05: P$3 0,1.025
ANTENNA-CHIP5 = smd 1.016 x 2.54: FEED -3.302,0; NC 3.302,0
CRYSTAL-SMD-5X3 = smd 1.9 x 1.1: 1 -1.85,-1.15; 2 1.85,-1.15; 3 1.85,1.15; 4 -1.85,1.15

### Placement (x,y rotation side)
B2  82.37,59.27 180 top
BATT1  56.52,56.52 180 bottom
C1  40.02,46.62 180 top
C2  40.07,49.12 180 top
C3  57.42,65.72 0 top
C4  69.07,45.77 180 top
C5  72.67,68.07 180 top
C6  76.62,49.67 270 top
C7  80.91,47.64 0 top
C8  80.91,52.07 0 top
C9  43.57,55.32 180 top
C10  84.82,62.82 90 top
C12  31.12,81.62 225 top
C13  81.92,81.62 315 top
C14  82.37,62.82 270 top
C15  73.07,45.77 0 top
C17  39.02,43.02 90 top
C18  47.87,50.02 0 top
C19  55.17,51.07 270 top
C20  57.77,51.07 270 top
C21  53.67,61.27 180 top
C22  51.52,56.37 270 top
C23  26.92,69.67 180 top
C25  26.92,43.37 180 top
C26  86.12,43.37 0 top
C28  86.12,69.67 0 top
C35  81.92,31.42 45 top
C36  31.12,31.42 135 top
D1  92.77,38.02 0 top
D2  92.77,75.07 0 top
D3  84.52,28.92 45 top
D4  28.52,84.12 225 top
D5  84.52,84.12 315 top
D7  28.52,28.92 135 top
FTDI  19.95,71.76 270 top
FTDI_(SERIAL_ONLY)  19.95,53.82 270 top
J1  45.32,41.92 180 top
J2  90.54,48.09 180 top
J3  67.85,72.75 180 top
PIN_3  87.52,87.52 315 top
PIN_4  87.52,25.52 45 top
PIN_5  25.52,25.52 135 top
PIN_8  25.52,87.52 225 top
R1  61.52,53.27 90 top
R2  26.92,41.22 0 top
R3  30.27,42.17 270 top
R4  82.77,42.17 270 top
R5  61.77,65.72 0 top
R6  63.92,53.27 90 top
R7  92.87,72.67 180 top
R8  92.82,40.42 0 top
R9  30.27,70.87 90 top
R10  82.77,70.87 90 top
R11  86.12,41.22 180 top
R12  26.92,71.82 0 top
R13  86.12,71.82 180 top
R14  36.72,61.82 270 top
R15  34.52,61.82 270 top
R16  32.42,61.82 270 top
SW1  44.34,62.93 90 top
U2  71.81,59.27 180 top
U$1  56.52,56.52 0 top
U$2  43.96,48.72 0 top
U$3  57.52,45.32 0 top
U$4  38.02,37.12 45 top
U$5  75.02,37.12 135 top
U$6  38.02,75.92 315 top
U$7  75.02,75.92 225 top
U$8  34.51,56.52 270 top
U$9  32.17,77.12 315 top
U$10  32.17,35.92 225 top
U$11  80.87,35.92 135 top
U$12  80.87,77.12 45 top
U$13  90.09,60.08 0 top
U$14  [UCSD_LOGO]  59.42,76.02 180 top
U$15  [EAGLE-PLC-8MM]  12.32,11.92 0 top
Y1  71.57,49.18 0 top

### Tracks (layer width: path | path; a pad name or v marks a point on that pad's centre or on a via)
3.3V  (via drill 0.6)
  Top 0.152: v65.02,62.52 65.02,64.77 64.27,65.52 62.77,65.52 R5.2
  Top 0.3: R1.1 R6.1 | U$1.P$18 C20.1 | 61.27,52.06 R1.1 | 61.42,52.21 R1.1 | 56.27,51.96 C19.1 53.57,51.96 v53.52,52.02 | 56.27,51.96 56.72,51.96 | 56.72,51.96 57.22,51.96 | 57.22,51.96 C20.1 | C20.1 61.12,51.91 R1.1 | U$1.P$17 57.27,52.01 57.22,51.96 | U$1.P$16 56.77,52.01 56.72,51.96 | U$1.P$15 56.27,51.96 | U2.34 v65.02,62.52 | U2.54 70.56,52.06 v70.52,52.02 | U2.59 73.06,54.48 73.02,54.52 v73.02,52.02 | v65.02,57.52 U2.44 | U2.23 72.56,65.98 v72.67,66.37
  Top 0.5: U$2.5 42.11,49.12 C2.1 41.02,49.26 v41.02,50.82 | C9.1 48.82,55.32 v49.22,55.62 | C7.1 C8.1 79.89,52.07 79.89,52.06 77.64,52.06 v77.64,52.1
  Bottom 0.152: v72.67,66.37 72.52,66.52 71.52,66.52 65.52,72.52 J3.2
  pour Route15: 30.02,68.52 30.02,44.52 78.52,44.52 78.52,68.52
AVDD
  Top 0.3: U2.60 73.56,53.33 74.47,52.42 75.87,52.42 76.12,52.17 76.12,51.06 C6.1
BAT_GND  (via drill 0.6)
  Top 0.3: 25.96,69.73 C23.2 | 25.96,43.31 C25.2 | R11.1 87.07,41.31
  Top 0.5: R12.1 25.96,70.22 25.96,70.12 | 25.96,70.12 25.96,69.73 | 25.96,43.31 R2.1 25.96,40.07 v27.52,38.52 | 87.07,41.31 C26.2 | R11.1 87.07,40.07 v86.52,39.52 | C28.2 87.07,69.73 R13.1 87.07,72.96 v85.52,74.52 | U$3.P$1 BATT1.- | v24.42,70.12 25.96,70.12
  Top 1: U$7.P$2 73.96,74.96 v72.52,73.52 | U$12.P$2 82.95,77.08 v85.52,74.52 | U$5.P$2 73.96,38.07 v72.52,39.52 | U$11.P$2 80.9,39.13 v80.52,39.52 | U$6.P$2 39.07,74.96 v40.52,73.52 | U$9.P$2 32.13,74.9 v33.52,73.52 | U$10.P$2 30.08,35.95 v27.52,38.52 | U$4.P$2 39.07,38.07 v40.52,39.52
  other vias: 73.52,73.52 84.52,74.52 73.52,39.52 81.52,39.52 32.52,73.52 39.52,73.52 39.52,39.52 28.52,38.52
  pour Route2: 21.52,75.52 21.52,37.52 87.52,37.52 87.72,43.52 27.52,43.52 27.52,69.52 87.52,69.52 87.52,75.52
DTR
  Top 0.152: C3.1 56.52,65.77 50.39,65.77 47.52,68.64 23.02,68.64 20.02,71.64 FTDI.DTR
DVDD
  Top 0.3: C5.1 73.56,65.52 | U2.22 73.06,64.65 73.06,65.02 73.56,65.52 | U2.21 73.56,65.02 73.56,65.52
GND  (via drill 0.6)  (2 unrouted)
  Top 0.152: D1.C 91.64,38.52 91.64,38.77 88.02,42.39 88.02,46.77 J2.6 | D2.C 91.64,74.52 91.64,73.77 87.89,70.02 87.89,68.02 87.39,67.52 v85.52,67.52 | 87.89,46.89 J2.6 | v84.02,46.52 87.7,46.52 J2.6 | J3.1 68.02,72.52 71.77,68.77 71.77,68.02 C5.2 71.77,67.77 71.77,65.77 72.02,65.52 72.02,64.27 U2.24 72.02,64.02 72.02,63.27 71.27,62.52 v69.02,62.52
  Top 0.3: C17.2 39.02,46.21 C1.2 | U$8.P$1 U$8.P$2 U$8.P$3 | SW1.4 50.86,65.18 v51.02,65.02 | C21.1 55.77,61.27 v56.02,61.02 | U$1.P$6 55.27,60.27 v56.02,61.02 | U$1.P$5 55.77,60.77 v56.02,61.02 | U$1.P$4 56.27,60.77 v56.02,61.02 | U$1.P$3 56.77,60.27 v56.02,61.02 | U$1.P$2 57.27,59.77 v56.02,61.02 | U$1.P$22 60.27,56.77 v60.52,57.02 60.27,57.27 U$1.P$23 | C19.2 C20.2 59.36,50.17 v59.52,50.02 | U2.20 74.06,65.56 v75.02,66.52 | v80.52,60.52 v80.52,65.52 | U2.7 75.52,58.52 v75.02,59.02 75.02,60.02 | U2.11 75.52,60.52 75.02,60.02 | U2.10 75.02,60.02 | v72.52,57.02 74.02,56.02 74.02,54.43 U2.61 | U2.58 72.56,55.98 v72.52,57.02 | U2.55 71.06,57.06 v72.52,57.02 | U2.45 v72.52,57.02 | U2.33 68.52,63.02 v69.02,62.52 68.52,62.02 U2.35 | C15.2 74.47,45.97 v75.52,47.02 75.52,47.67 C6.2 | 66.57,45.77 C4.2 | SW1.3 42.16,65.18 v42.32,65.02
  Top 0.5: C9.2 38.32,55.32 v38.02,55.02 37.32,54.32 U$8.P$3 | v37.52,46.52 39.32,46.52 | 39.37,46.67 C1.2 39.12,49.12 C2.2 | U$2.2 43.96,45.96 v43.52,45.52 | U$3.P$2 v60.02,45.32 | C18.2 48.76,48.06 v48.72,48.12 | C8.2 C7.2 82.9,47.64 v84.02,46.52
  Route2 0.152: v85.52,67.52 76.52,67.52 75.52,66.52
  Route2 0.3: v80.52,65.52 80.02,65.52 79.02,66.52 75.52,66.52 v75.02,66.52
  Route2 0.5: v84.02,46.52 76.02,46.52 v75.52,47.02
  Bottom 0.152: FTDI_(SERIAL_ONLY).GND 20.02,41.14 26.14,41.14 31.77,46.77 20.02,58.52 20.02,59.02 FTDI.GND
  Bottom 0.406: 31.77,46.77 37.52,46.77 v37.52,46.52
  other vias: 80.52,61.52 80.52,64.52 80.52,63.52 80.52,62.52 81.52,65.52 82.52,65.52 83.52,65.52 84.52,65.52 85.52,65.52 86.52,65.52 86.52,64.52 86.52,63.52 86.52,62.52 85.52,58.02 84.52,58.02 86.52,58.02 86.52,57.02 85.52,57.02 84.52,57.02 83.52,57.02 82.52,57.02 81.52,57.02 80.52,57.02 80.52,58.02 66.52,45.82
  pour Top: 80.02,66.02 80.02,56.52 87.02,56.52 87.02,66.02
  pour Route2: 80.02,66.02 80.02,56.52 87.02,56.52 87.02,66.02
  pour Route2: 30.02,68.02 30.02,44.52 78.52,44.52 78.52,45.52 78.52,68.52 30.02,68.52
MISO  (via drill 0.38)
  Top 0.152: U2.39 68.14,60.02 v68.27,59.89
  Bottom 0.152: v68.27,59.89 83.38,44.78 91.8,44.78 91.8,48.04 91.89,48.14 93.02,49.27 J2.1
MOSI  (via drill 0.38)
  Top 0.152: U2.38 69.39,60.52 v69.64,60.27
  Bottom 0.152: v69.64,60.27 72.14,57.77 74.39,57.77 86.79,45.37 89.06,45.37 90.46,46.77 90.52,46.77 J2.4
N$1
  Top 0.5: U$8.P$4 36.31,60.45 R14.2
N$2
  Top 0.5: U$8.P$5 R15.2
N$3
  Top 0.3: U2.57 72.06,50.82 | 72.06,50.82 72.06,50.02 | 72.06,46.35 C15.1 72.06,45.88 72.06,50.02 | 72.07,50.83 72.06,50.82 | Y1.3 72.37,50.33 72.06,50.02
N$4
  Top 0.3: U2.56 71.56,48.02 | 71.56,48.02 71.56,47.36 C4.1 | Y1.1 71.55,48.03 71.56,48.02
N$5
  Top 0.3: U$2.4 45.02,50.02
  Top 0.5: 45.02,50.02 C18.1
N$6
  Top 0.3: U$1.P$7 52.77,57.77 52.77,60.87 C21.2
N$7
  Top 0.3: C14.2 B2.2
N$8
  Top 0.152: D2.A 93.89,74.52 93.89,72.77 R7.1
N$9
  Top 0.5: U$8.P$6 32.71,60.57 R16.2
N$10
  cutout Route2: 87.52,67.02 87.52,54.02 96.02,54.02 96.02,67.02
N$11
  cutout Route15: 87.52,67.02 87.52,54.02 96.02,54.02 96.02,67.02
N$12
  Top 0.3: C22.1 U$1.P$8
N$13
  Top 0.152: D1.A 93.77,38.52 91.89,40.39 R8.1
N$14
  Top 0.3: C22.2 52.67,55.47 52.87,55.67 52.87,56.57 53.07,56.77 U$1.P$9
N$15
  Top 0.3: U$1.P$19 60.47,55.27 R1.2
N$16
  Top 0.3: U$1.P$20 62.37,55.77 R6.2
N$17
  Top 0.3: 53.96,41.9 BATT1.+
  Top 0.406: J1.1 BATT1.+
N$18
  Top 0.3: 30.27,76.56 U$9.P$1 | R12.2
  Top 0.5: 30.27,76.56 R9.2 R12.2
N$19
  Top 1: PIN_8.V- 24.18,86.1 D4.A 28.53,82.94 C12.2 32.89,78.58 U$9.P$3
N$20
  cutout Route2: 54.02,59.02 54.02,54.02 59.02,54.02 59.02,59.02
N$21
  Top 0.3: U$10.P$1 32.13,37.35 | R2.2
  Top 0.5: R2.2 R3.2 30.27,39.16 U$10.P$1
N$22
  Top 1: PIN_5.V- 24.18,26.93 D7.A 28.53,30.1 C36.2 32.89,34.46 U$10.P$3
N$23
  cutout Route15: 54.02,59.02 54.02,54.02 59.02,54.02 59.02,59.02
N$24
  Top 0.3: U$12.P$1 80.9,75.69 | R13.2
  Top 0.5: R13.2 R10.2 82.77,73.87 U$12.P$1
N$25
  Top 1: PIN_3.V- 88.38,85.63 D5.A 84.51,82.94 C13.2 80.09,78.53 U$12.P$3
N$26
  cutout Route2 (no thermals): 47.83,69.02 47.83,67.24 50.52,67.24 50.52,69.96 47.83,69.96 47.83,68.99
  cutout Route2 (no thermals): 62.54,68.99 62.54,67.21 65.23,67.21 65.23,69.93 62.54,69.93 62.54,68.96
  cutout Route2 (no thermals): 62.54,68.99 62.54,67.21 65.23,67.21 65.23,69.93 62.54,69.93 62.54,68.96
  cutout Route2 (no thermals): 62.51,44.91 62.51,43.13 65.21,43.13 65.21,45.85 62.51,45.85 62.51,44.89
  cutout Route2 (no thermals): 62.51,44.91 62.51,43.13 65.21,43.13 65.21,45.85 62.51,45.85 62.51,44.89
  cutout Route2 (no thermals): 47.81,44.89 47.81,43.11 50.5,43.11 50.5,45.83 47.81,45.83 47.81,44.86
  cutout Route2 (no thermals): 47.81,44.89 47.81,43.11 50.5,43.11 50.5,45.83 47.81,45.83 47.81,44.86
  cutout Route15 (no thermals): 47.81,44.89 47.81,43.11 50.5,43.11 50.5,45.83 47.81,45.83 47.81,44.86
  cutout Route15 (no thermals): 62.51,44.91 62.51,43.13 65.21,43.13 65.21,45.85 62.51,45.85 62.51,44.89
  cutout Route15 (no thermals): 62.54,68.99 62.54,67.21 65.23,67.21 65.23,69.93 62.54,69.93 62.54,68.96
  cutout Route15 (no thermals): 47.83,69.02 47.83,67.24 50.52,67.24 50.52,69.96 47.83,69.96 47.83,68.99
N$27
  Top 0.3: 82.77,36.47 U$11.P$1 | R11.2
  Top 0.5: 82.77,36.47 R4.2 R11.2
N$28
  Top 1: PIN_4.V- 88.86,26.93 D3.A 84.51,30.1 C35.2 80.14,34.46 U$11.P$3
PB4  (via drill 0.38)
  Top 0.152: U2.40 65.02,59.52 64.77,59.77 v59.77,59.77
  Bottom 0.152: v59.77,59.77 59.77,60.52 47.77,72.52 J3.9
PB5  (via drill 0.38)
  Top 0.152: v64.52,59.02 U2.41 | R9.1 30.27,70.02 40.52,70.02 44.52,74.02 53.77,74.02 55.02,72.77 J3.6
  Top 0.3: 28.06,69.91 C23.1
  Top 0.5: R9.1 28.06,69.91
  Bottom 0.152: v64.52,59.02 64.02,59.02 55.27,67.77 55.27,72.52 J3.6
PB6  (via drill 0.38)
  Top 0.152: v91.02,71.77 91.89,72.64 R7.2 | v73.39,61.52 72.89,61.52 69.89,58.52 U2.42
  Bottom 0.152: v91.02,71.77 83.64,71.77 v73.39,61.52
PB7  (via drill 0.38)
  Top 0.152: v69.14,57.89 67.14,57.89 67.02,58.02 U2.43 | R8.2 93.77,40.52 93.77,40.92 v92.69,41.99
  Bottom 0.152: v69.14,57.89 69.64,57.89 85.54,41.99 v92.69,41.99
PE2
  Top 0.152: R14.1 36.77,62.77 36.77,62.27 38.39,60.64 38.39,59.89 41.52,56.77 42.64,56.77 48.27,51.14 64.14,51.14 66.89,53.89 66.89,55.52 U2.48
PE3  (via drill 0.38)
  Top 0.152: v70.27,56.27 70.14,56.39 69.02,56.39 68.14,55.52 68.14,54.39 U2.49 | R10.1 82.77,70.02 72.77,70.02 68.77,74.02 64.02,74.02 62.77,72.77 J3.3
  Top 0.3: 85.03,69.91 C28.1
  Top 0.5: R10.1 85.03,69.91
  Route2 0.152: 77.77,63.77 v70.27,56.27
  Bottom 0.152: v70.27,56.27 69.27,57.27 68.77,57.27 62.77,63.27 J3.3
PE4  (via drill 0.38)
  Top 0.152: v68.27,53.02 68.52,53.27 68.52,54.27 U2.50 | v80.92,43.27 82.77,43.27 R4.1
  Top 0.3: 84.98,43.12 C26.1
  Top 0.5: R4.1 84.98,43.12
  Bottom 0.152: J3.4 60.27,72.52 60.27,65.27 68.27,57.27 v68.27,53.02 68.27,52.77 77.77,43.27 v80.92,43.27
PE5  (via drill 0.38)
  Top 0.152: v67.27,53.02 68.02,52.27 68.52,52.27 69.02,52.77 69.02,54.27 U2.51 | v50.02,40.52 39.02,40.52 36.52,43.02 30.27,43.02 R3.1
  Top 0.3: 28.06,43.12 C25.1
  Top 0.5: R3.1 28.06,43.12
  Bottom 0.152: J3.5 57.77,72.52 57.77,65.77 59.27,64.27 60.27,64.27 67.27,57.27 v67.27,53.02 63.52,49.27 58.77,49.27 v50.02,40.52
PE6
  Top 0.152: R15.1 34.52,62.89 33.64,62.89 33.02,63.52 31.77,63.52 31.39,63.14 31.39,53.02 32.69,51.72 47.12,51.72 47.92,50.92 47.92,48.82 47.64,48.54 47.64,47.52 47.89,47.27 64.27,47.27 69.52,52.52 69.52,54.27 U2.52
PE7  (via drill 0.38)
  Top 0.152: v55.02,63.27 54.77,63.52 36.02,63.52 35.77,63.27 35.77,62.64 35.14,62.02 33.89,62.02 33.14,62.77 32.52,62.77 R16.1 | v69.39,55.77 69.64,55.52 69.77,55.52 70.02,55.27 70.02,54.39 U2.53
  Route2 0.152: v55.02,63.27 57.39,63.27 64.89,55.77 v69.39,55.77
PG5  (via drill 0.38)
  Top 0.152: v73.52,62.77 74.02,62.77 74.52,63.27 74.52,64.02 U2.19
  Bottom 0.152: v73.52,62.77 64.02,72.27 64.02,73.02 62.02,75.02 47.27,75.02 45.02,72.77 J3.10
RESET  (via drill 0.38)
  Top 0.152: U2.12 77.52,61.02 v78.14,60.39 | SW1.1 39.89,60.77 48.77,60.77 SW1.2 48.89,60.77 50.39,62.27 55.02,62.27 57.77,65.02 57.77,65.14 58.27,65.64 C3.2 58.39,65.77 60.77,65.77 R5.1 60.89,65.64 62.14,64.39 v64.27,64.39
  Bottom 0.152: J2.5 87.89,49.39 84.14,49.39 78.14,55.39 v78.14,60.39 73.52,60.39 69.52,64.39 v64.27,64.39
RFANT
  Top 0.3: C10.1 84.77,61.87
  Top 0.406: B2.1 85.02,60.07 | 85.02,60.07 86.59,60.07 U$13.FEED | 84.77,61.87 85.02,61.87 85.02,60.07
RFN
  Top 0.3: U2.9 81.12,59.52 B2.3
RFP
  Top 0.3: U2.8 81.22,59.02 B2.4
RX0  (via drill 0.38)
  Top 0.152: v62.64,56.52 U2.46
  Bottom 0.152: FTDI.TXO 20.02,66.64 34.27,52.39 34.27,47.89 34.89,47.27 53.39,47.27 v62.64,56.52
RX1  (via drill 0.38)
  Top 0.152: v52.02,67.27 68.27,67.27 70.52,65.02 70.52,64.27 U2.27 | v30.77,59.52 20.02,48.77 FTDI_(SERIAL_ONLY).TXO
  Bottom 0.152: v52.02,67.27 38.52,67.27 v30.77,59.52
SCK  (via drill 0.38)
  Top 0.152: U2.37 69.89,61.02 v70.64,60.27
  Bottom 0.152: v70.64,60.27 72.39,60.27 77.39,55.27 77.77,55.27 84.89,48.09 89.24,48.09 90.52,49.27 J2.3
SCL  (via drill 0.38)
  Top 0.152: U2.25 71.52,64.27 71.52,65.02 65.02,71.52 51.27,71.52 50.27,72.52 J3.8 | U$1.P$21 61.27,56.27 v63.52,58.52
  Bottom 0.152: v63.52,58.52 63.52,59.02 50.02,72.52 J3.8
SDA  (via drill 0.38)
  Top 0.152: v54.52,70.77 65.27,70.77 71.02,65.02 71.02,64.27 U2.26 | v59.52,65.02 59.02,64.52 59.02,57.77 U$1.P$24
  Bottom 0.152: v54.52,70.77 52.77,72.52 J3.7 52.77,72.77 54.02,74.02 58.02,74.02 58.77,73.27 58.77,72.52 59.52,71.77 v59.52,65.02
TX0  (via drill 0.38)
  Top 0.152: U2.47 63.77,56.02 v63.52,55.77
  Bottom 0.152: FTDI.RXI 19.89,69.14 18.77,68.02 18.77,40.64 19.52,39.89 20.39,39.89 20.77,40.27 48.82,40.27 50.42,41.87 50.42,46.27 54.07,46.27 54.07,46.32 v63.52,55.77
TX1
  Top 0.152: U2.28 70.02,64.27 70.02,65.02 68.27,66.77 57.89,66.77 57.39,66.27 57.39,65.14 56.14,63.89 31.64,63.89 21.14,53.39 21.14,52.52 20.02,51.39 FTDI_(SERIAL_ONLY).RXI
VCC  (via drill 0.6)
  Top 0.3: 42.48,43.52 42.52,43.52 42.52,43.62
  Top 0.5: 42.48,46.62 42.48,43.52 42.78,43.52 | 42.48,46.62 42.98,47.39 U$2.1 | 42.78,43.52 44.32,43.52 44.91,44.11 U$2.3 | C1.1 42.48,46.62 | 42.78,43.52 J1.2 42.78,42.12 C17.1
  Top 1: PIN_3.V+ 86.07,88.03 D5.C 83.34,84.31 C13.1 81.29,82.19 U$7.P$1 75.97,76.06 v78.52,73.52 | PIN_5.V+ 26.77,24.81 D7.C 29.7,28.73 C36.1 37.06,36.1 U$4.P$1 35.52,37.71 v35.52,39.52 | PIN_4.V+ 86.27,24.81 D3.C 83.34,28.73 C35.1 81.29,30.85 U$5.P$1 75.97,36.97 v78.52,39.52 | PIN_8.V+ 26.77,88.23 D4.C 29.7,84.31 C12.1 31.75,82.19 U$6.P$1 36.52,76.33 v36.52,73.52
  other vias: 77.52,73.52 77.52,39.52 35.52,73.52 36.52,39.52
  pour Route15: 21.52,75.52 21.52,37.52 87.52,37.52 87.72,43.52 27.52,43.52 27.52,69.52 87.52,69.52 87.52,75.52
(copper drawn outside any net)
  shapes: Top area x2